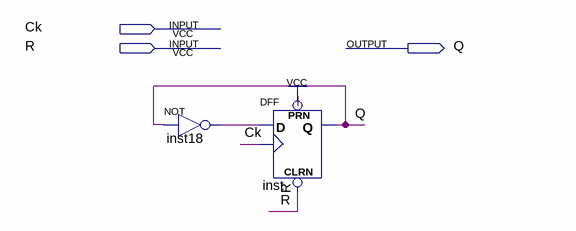
[diagram p0: schematic sheet]
// Quartus schematic freq_div.bdf as structural Verilog: 2 symbols, 3 pins
module freq_div (
  input  Ck,
  input  R,
  output Q
);

  wire inst18_out;

  not inst18 (inst18_out, Q);
  DFF inst (.CLRN(R), .CLK(Ck), .D(inst18_out), .PRN(1'b1), .Q(Q));
endmodule
